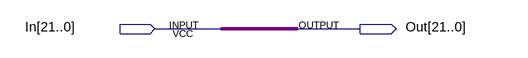
[diagram p0: schematic sheet]
// Quartus schematic ConvertBus22bit.bdf as structural Verilog: 0 symbols, 2 pins
module ConvertBus22bit (
  input  [21:0] In,
  output [21:0] Out
);


  assign Out = In;
endmodule
